# Altium schematic sheet dmpro16-pcb-v1-UserInput.SchDoc
size A4; DocumentNumber: 17; SheetNumber: 17; SheetTotal: 17; SheetName: UserInput
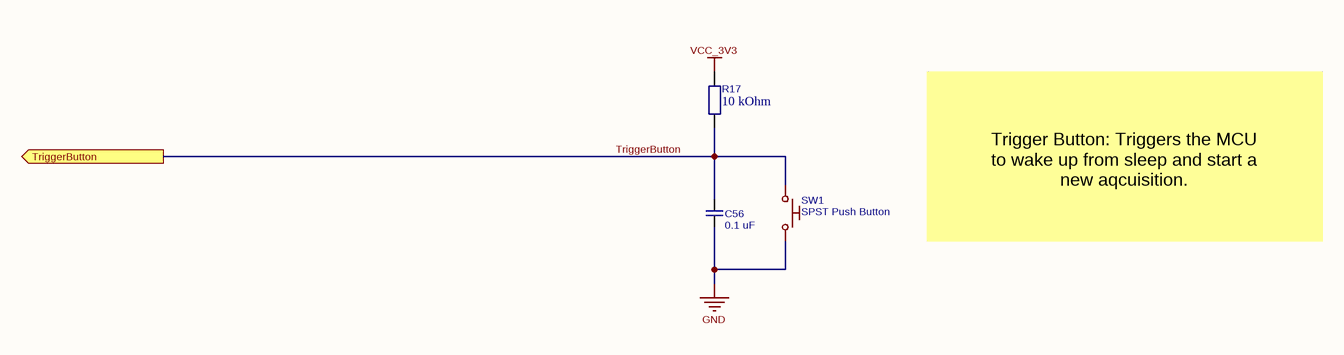
[diagram p0: dmpro16-pcb-v1-UserInput.SchDoc]

## Parts
C56  0.1 uF  [CAPC2012_0h50]
R17  10 kOhm  [Resistor 2012]
SW1  SPST Push Button  [HEADER_1X2]

## Ports
TriggerButton (out)

## Nets
GND: C56.1 SW1.2
VCC_3V3: R17.1
TriggerButton: C56.2 R17.2 SW1.1 ; port TriggerButton

## Notes on the sheet
- Trigger Button: Triggers the MCU to wake up from sleep and start a new aqcuisition.
- Board:
- Version:
- Sheetname:
- Subject:
- Group:
- Sheet
- of
- Shematic file:

## Library data of the parts
C56 = cap_unpol_1608_0.1uF: 0.1 uF unpolarized capacitor (1608 size); Voltage Rating: 6.3 V; Body Size (metric): 1608; Ideal Value: 0.1 uF
R17 = res_1608_10kohm: 10 kOhm resistor (1608 metric); Watt rating: ? mW; Value: 10 kOhm
SW1 = mech_button_spst: Single Pole Single Throw Push Button